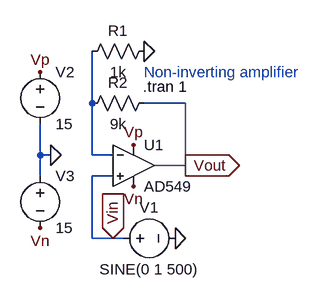
[diagram p0: schematic sch.asc]
sch.asc, the LTspice schematic file:
Version 4
SHEET 1 880 680
WIRE 176 96 176 16
WIRE 320 96 256 96
WIRE 96 176 96 128
WIRE 112 176 96 176
WIRE 176 176 176 96
WIRE 208 176 176 176
WIRE 320 192 320 96
WIRE 320 192 272 192
WIRE 96 208 96 176
WIRE 208 208 176 208
WIRE 176 304 176 208
WIRE 208 304 176 304
WIRE 224 304 208 304
FLAG 256 16 0
FLAG 304 304 0
FLAG 112 176 0
FLAG 96 288 Vn
FLAG 240 224 Vn
FLAG 96 48 Vp
FLAG 240 160 Vp
FLAG 320 192 Vout
IOPIN 320 192 Out
FLAG 208 304 Vin
IOPIN 208 304 In
SYMBOL OpAmps\\AD549 240 128 R0
SYMATTR InstName U1
SYMBOL res 272 0 R90
WINDOW 0 0 56 VBottom 2
WINDOW 3 32 56 VTop 2
SYMATTR InstName R1
SYMATTR Value 1k
SYMBOL res 272 80 R90
WINDOW 0 0 56 VBottom 2
WINDOW 3 32 56 VTop 2
SYMATTR InstName R2
SYMATTR Value 9k
SYMBOL voltage 208 304 R270
WINDOW 0 32 56 VTop 2
WINDOW 3 -32 56 VBottom 2
WINDOW 123 0 0 Left 0
WINDOW 39 0 0 Left 0
SYMATTR InstName V1
SYMATTR Value SINE(0 1 500)
SYMBOL voltage 96 32 R0
WINDOW 123 0 0 Left 0
WINDOW 39 0 0 Left 0
SYMATTR InstName V2
SYMATTR Value 15
SYMBOL voltage 96 192 R0
WINDOW 123 0 0 Left 0
WINDOW 39 0 0 Left 0
SYMATTR InstName V3
SYMATTR Value 15
TEXT 256 48 Left 2 ;Non-inverting amplifier
TEXT 254 70 Left 2 !.tran 1

The netlist it stands for:
* sch.asc
XU1 Vin N001 Vp Vn Vout AD549  ; pins In+ In- V+ V- OUT
R1 0 N001 1k
R2 Vout N001 9k
V1 Vin 0 SINE(0 1 500)
V2 Vp 0 15
V3 0 Vn 15
* Non-inverting amplifier
.tran 1
.backanno
.end